# Altium schematic sheet RADM-Power-S02-V00.SchDoc: RADM Power (Filtering, USB)
size A3; DrawnBy: Jonn Dillon; DocumentNumber: 3; SheetNumber: 3; SheetTotal: 6; Version: 00; Project: QUTMS RADIO M2M; PageSetup: Record=PageOptions|CenterHorizontal=True|CenterVertical=True|PrintScale=0.97|XCorrection=1.00|YCorrection=1.00|PrintKind=0|BorderSize=5000000|LeftOffset=0|BottomOffset=0|Orientation=2|PaperLength=1000|PaperWidth=1000|Scale=100|PaperSource=7|PrintQuality=-4|MediaType=1|DitherType=10|PaperKind=A4|PrintScaleMode=1
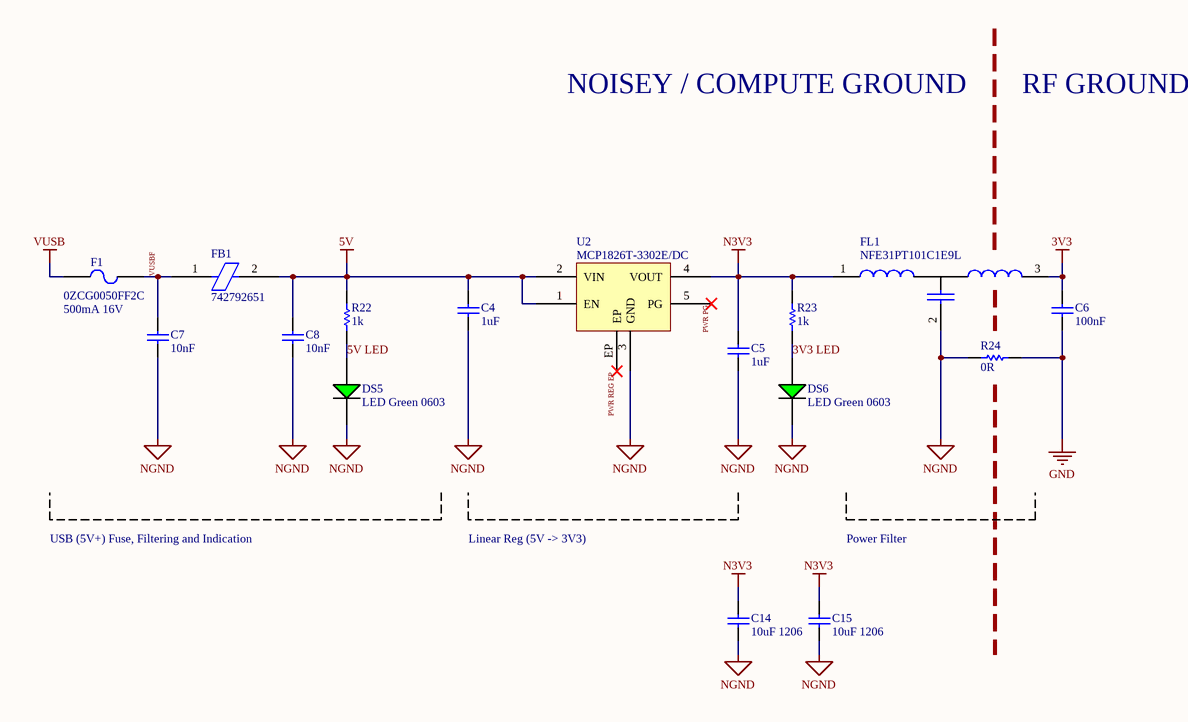
[diagram p0: RADM-Power-S02-V00.SchDoc]

## Parts
C4  1uF  [Cap_Ceramic_0603]
C5  1uF  [Cap_Ceramic_0603]
C6  100nF  [Cap_Ceramic_0603]
C7  10nF  [Cap_Ceramic_0603]
C8  10nF  [Cap_Ceramic_0603]
C14  10uF 1206  [Cap_Ceramic_1206]
C15  10uF 1206  [Cap_Ceramic_1206]
DS5  LED Green 0603  [LED GREEN 0603]
DS6  LED Green 0603  [LED GREEN 0603]
F1  0ZCG0050FF2C  [1812 FUSE]
FB1  742792651  [Inductor_0603]
FL1  NFE31PT101C1E9L  [NFE31PT101C1E9L]
R22  1k  [Res_ThinFilm_0603]
R23  1k  [Res_ThinFilm_0603]
R24  0R  [Res_ThinFilm_0603]
U2  MCP1826T-3302E/DC  [SOT-223-5]

## Nets
3V3: C6.2 FL1.3
5V: C4.2 C8.2 FB1.2 R22.2 U2.1(EN) U2.2(VIN)
GND: C6.1 R24.2
N3V3: C5.2 C14.2 C15.2 FL1.1 R23.2 U2.4(VOUT)
NGND: C4.1 C5.1 C7.1 C8.1 C14.1 C15.1 DS5.2(C) DS6.2(C) FL1.2 R24.1 U2.3(GND)
VUSB: F1.1
3V3 LED: DS6.1(A) R23.1
5V LED: DS5.1(A) R22.1
PWR PG: U2.5(PG)
PWR REG EP: U2.EP
VUSBF: C7.2 F1.2 FB1.1

## Notes on the sheet
- NOISEY / COMPUTE GROUND
- RF GROUND
- 500mA 16V
- USB (5V+) Fuse, Filtering and Indication
- Linear Reg (5V -> 3V3)
- Power Filter
- Revision History:
- Sheet Title:
- Rev
- Date
- Description
- Project:
- Size:
- Drawn By:
- A3
- Number:
- Revision:
- Sheet
- Version:
- of
- QUT Motorsport
- O-120, Gardens Point
- 2 George Street
- Brisbane, QLD 4000
- Australia
- Print Date:
- Print Time:
- File Name:

## Library data of the parts
C4 C5 = 1uF 25V 5% X7R 0603: Capacitor, Ceramic, SMD, 1uF, 25V, 5%, X7R, 0603
C6 = 100nF 50V 5% X7R 0603: Capacitor, Ceramic, SMD, 100nF, 50V, 5%, X7R, 0603
C7 C8 = 10nF 50V 5% X7R 0603: Capacitor, Ceramic, SMD, 10nF, 50V, 5%, X7R, 0603
C14 C15 = 10uF 25V 10% X7R 1206: Capacitor, Ceramic, SMD, 10uF, 25V, 10%, X7R, 1206
F1 = 0ZCG0050FF2C: Polymeric PTC Resettable Fuse 16V 500mA Ih Surface Mount 1812 (4532 Metric), Concave
FB1 = 742792651: 600 Ohms @ 100MHz 1 Signal Line Ferrite Bead 0603 (1608 Metric) 1A 200mOhm
FL1 = NFE31PT101C1E9L: LC (T-Type) EMI Filter 3rd Order Low Pass 1 Channel C = 100pF 6A 1206 (3216 Metric), 3 PC Pad
R22 R23 = 1k 5% 0603: Resistor, SMD, 1k, 0.1W, 5%, 0603
R24 = 0R 5% 0603: Resistor, SMD, 0R, 0.1W, 5%, 0603
U2 = MCP1826T-3302E/DC: Linear Voltage Regulator IC Positive Fixed 1 Output 1A SOT-223-5